# Altium schematic sheet relay_m66.SchDoc
size B; SheetNumber: 1; SheetTotal: 1
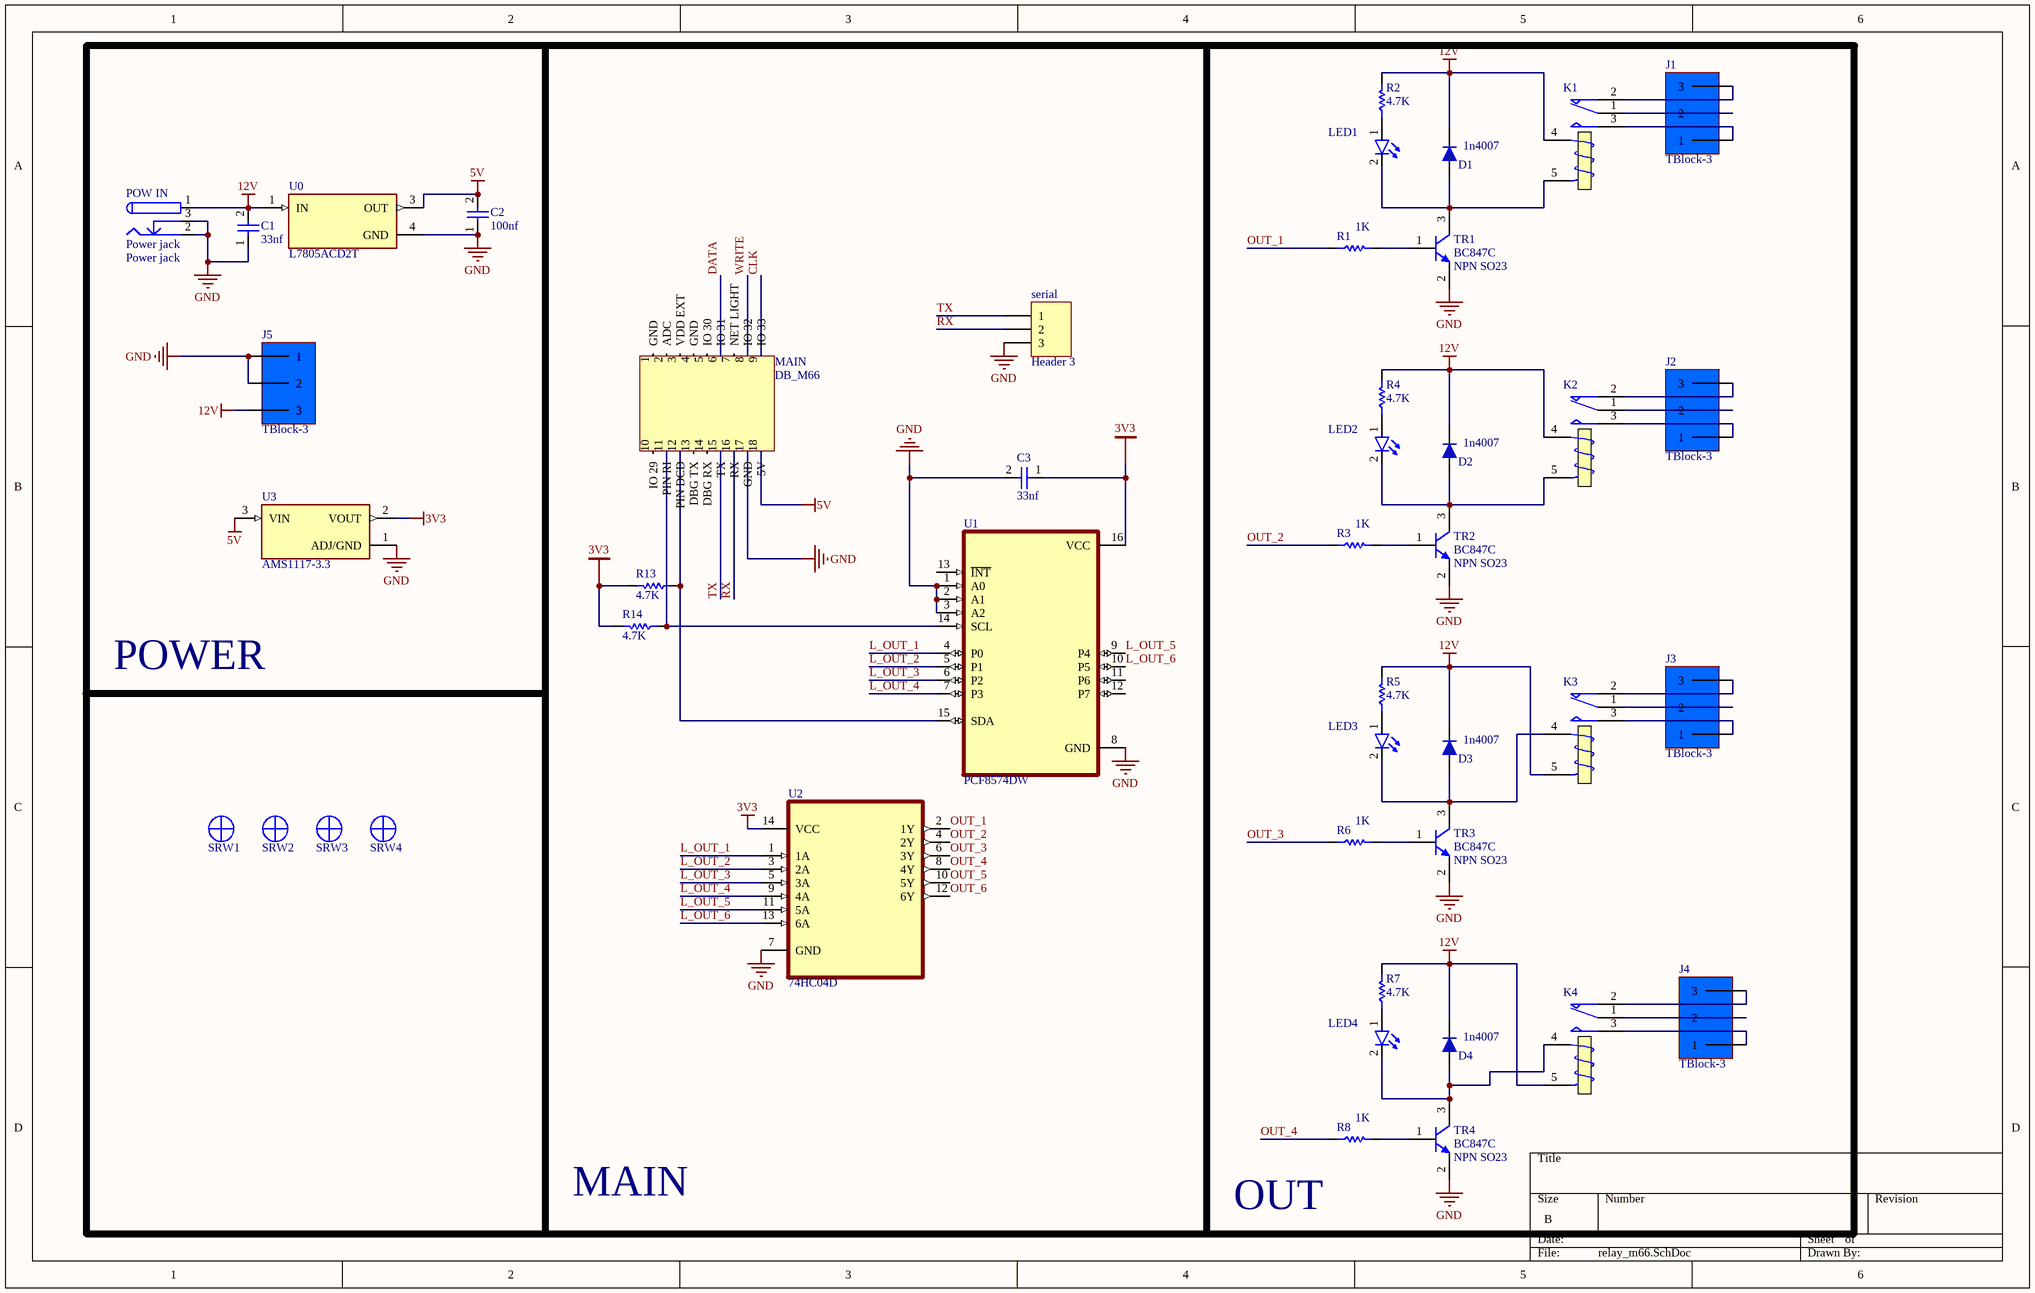
[diagram p0: relay_m66.SchDoc]

## Parts
C1  33nf  [SMD 0805]
C2  100nf  [SMD 0805]
C3  33nf  [SMD 0805]
D1  1n4007  [DIOM4629X24N]
D2  1n4007  [DIOM4629X24N]
D3  1n4007  [DIOM4629X24N]
D4  1n4007  [DIOM4629X24N]
J1  TBlock-3  [KF300-3 PIN]
J2  TBlock-3  [KF300-3 PIN]
J3  TBlock-3  [KF300-3 PIN]
J4  TBlock-3  [KF300-3 PIN]
J5  TBlock-3  [KF300-3 PIN]
K1  (no value)  [Relay 18.85x15.35x15.70]
K2  (no value)  [Relay 18.85x15.35x15.70]
K3  (no value)  [Relay 18.85x15.35x15.70]
K4  (no value)  [Relay 18.85x15.35x15.70]
LED1  LED 2PIN  [LED 0805]  (value not drawn)
LED2  LED 2PIN  [LED 0805]  (value not drawn)
LED3  LED 2PIN  [LED 0805]  (value not drawn)
LED4  LED 2PIN  [LED 0805]  (value not drawn)
MAIN  DB_M66  [DB_M66]
POW_IN  Power jack  [Power Jack]
R1  1K  [0805_1/8W]
R2  4.7K  [0805_1/8W]
R3  1K  [0805_1/8W]
R4  4.7K  [0805_1/8W]
R5  4.7K  [0805_1/8W]
R6  1K  [0805_1/8W]
R7  4.7K  [0805_1/8W]
R8  1K  [0805_1/8W]
R13  4.7K  [0805_1/8W]
R14  4.7K  [0805_1/8W]
serial  Header 3  [HDR1X3]
SRW1  Screw  [Board Screw]  (value not drawn)
SRW2  Screw  [Board Screw]  (value not drawn)
SRW3  Screw  [Board Screw]  (value not drawn)
SRW4  Screw  [Board Screw]  (value not drawn)
TR1  BC847C  [SOT23_BEC_M]
TR2  BC847C  [SOT23_BEC_M]
TR3  BC847C  [SOT23_BEC_M]
TR4  BC847C  [SOT23_BEC_M]
U0  L7805ACD2T  [VREG_L7805ACD2T]
U1  PCF8574DW  [SOIC127P1030X265-16N]
U2  74HC04D  [SOIC127P600X175-14N]
U3  AMS1117-3.3  [SOT229P700X180-4N]

## Nets
3V3: C3.1 R13.2 R14.2 U1.16(VCC) U2.14(VCC) U3.2(VOUT)
5V: C2.2 MAIN.18(5V) U0.3(OUT) U3.3(VIN)
12V: C1.2 D1.2 D2.2 D3.2 D4.2 J5.3 K1.4(T1) K2.4(T1) K3.5(T2) K4.5(T2) POW_IN.1 R2.2 R4.2 R5.2 R7.2 U0.1(IN)
GND: C1.1 C2.1 C3.2 J5.1 J5.2 MAIN.17(GND) POW_IN.2 POW_IN.3 serial.3 TR1.2(E) TR2.2(E) TR3.2(E) TR4.2(E) U0.4(GND) U1.1(A0) U1.2(A1) U1.3(A2) U1.8(GND) U2.7(GND) U3.1(ADJ/GND)
CLK: MAIN.9(IO_33)
DATA: MAIN.6(IO_31)
L_OUT_1: U1.4(P0) U2.1(1A)
L_OUT_2: U1.5(P1) U2.3(2A)
L_OUT_3: U1.6(P2) U2.5(3A)
L_OUT_4: U1.7(P3) U2.9(4A)
L_OUT_5: U1.9(P4) U2.11(5A)
L_OUT_6: U1.10(P5) U2.13(6A)
OUT_1: R1.1 U2.2(1Y)
OUT_2: R3.1 U2.4(2Y)
OUT_3: R6.1 U2.6(3Y)
OUT_4: R8.1 U2.8(4Y)
OUT_5: U2.10(5Y)
OUT_6: U2.12(6Y)
RX: MAIN.16(RX) serial.2
TX: MAIN.15(TX) serial.1
WRITE: MAIN.8(IO_32)
NetD1_1: D1.1 K1.5(T2) LED1.2(K) TR1.3(C)
NetD2_1: D2.1 K2.5(T2) LED2.2(K) TR2.3(C)
NetD3_1: D3.1 K3.4(T1) LED3.2(K) TR3.3(C)
NetD4_1: D4.1 K4.4(T1) LED4.2(K) TR4.3(C)
NetJ1_1: J1.1 K1.3(NO)
NetJ1_2: J1.2 K1.1(COM)
NetJ1_3: J1.3 K1.2(NC)
NetJ2_1: J2.1 K2.3(NO)
NetJ2_2: J2.2 K2.1(COM)
NetJ2_3: J2.3 K2.2(NC)
NetJ3_1: J3.1 K3.3(NO)
NetJ3_2: J3.2 K3.1(COM)
NetJ3_3: J3.3 K3.2(NC)
NetJ4_1: J4.1 K4.3(NO)
NetJ4_2: J4.2 K4.1(COM)
NetJ4_3: J4.3 K4.2(NC)
NetLED1_1: LED1.1(A) R2.1
NetLED2_1: LED2.1(A) R4.1
NetLED3_1: LED3.1(A) R5.1
NetLED4_1: LED4.1(A) R7.1
NetMAIN_11: MAIN.11(PIN_RI) R14.1 U1.14(SCL)
NetMAIN_12: MAIN.12(PIN_DCD) R13.1 U1.15(SDA)
NetR1_2: R1.2 TR1.1(B)
NetR3_2: R3.2 TR2.1(B)
NetR6_2: R6.2 TR3.1(B)
NetR8_2: R8.2 TR4.1(B)

Not connected (* = marked no-connect by the designer): MAIN 1(GND) 2(ADC) 3(VDD_EXT) 4(GND) 5(IO_30) 7(NET_LIGHT) 10(IO_29) 13(DBG_TX) 14(DBG_RX); U1 11(P6) 12(P7) 13(~{INT})

## Notes on the sheet
- POWER
- MAIN
- (near R8) OUT
- (in symbol NPN SMD) NPN SO23

## Library data of the parts
C1-C3 = CAP NON
D1-D4 = 1n4007 SMD M7: Standard Rectifiers; Part. No: M7; Manufacturer: DC COMPONENTS; Designer: Abbas Basereh; Link: http://www.tme.eu/en/details/m7/smd-universal-diodes/dc-components/; Link: https://www.aliexpress.com/item/Smd-tube-1n4007-m7-SMA/1213719741.html?spm=2114.01010208.3.1.ZyZ7bC&ws_ab_test=searchweb0_0,searchweb201602_4_10065_10068_10084_10083_10080_10082_10081_10060_10061_10062_10056_10055_10054_10059_10099_10078_10079_427_10073_10103_10102_10096_10052_10050_10051,searchweb201603_4&btsid=db2be5ca-e560-400a-b91c-484ab5ee228b; Data: 16-12-2016
K1-K4 = Relay_SPDT: Single-Pole Dual-Throw Relay; Designer: Abbas Basereh; Mounting Technology: Through-Hole; ComponentLink1Description: Datasheet; Pin Count: 0; Update Date: 2017-3-1
R1-R8 R13 R14 = RESISTOR
serial = Header 3: Header, 3-Pin; LatestRevisionDate: 17-Jul-2002; LatestRevisionNote: Re-released for DXP Platform.; Publisher: Altium Limited
SRW1-SRW4 = Board Screw 3MM: Board Screw With Spacer
TR1-TR4 = NPN SMD
U0 = L7805ACD2T: Linear Voltage Regulator IC 1 Output 1.5A D2PAK; MF: STMicroelectronics; Value: *; SnapEDA_Link: https://www.snapeda.com/parts/L7805ACD2T/STMicroelectronics/view-part/680973/?ref=snap; Price: None; Availability: Unavailable; Package: D2PAK STMicroelectronics; MP: L7805ACD2T
U1 = PCF8574DW: Remote 8-Bit I/O Expander for I2C-Bus 16-SOIC -40 to 85; MF: Texas Instruments; Package: SOIC-16 Texas Instruments; SnapEDA_Link: https://www.snapeda.com/parts/PCF8574DW/Texas%20Instruments/view-part/480923/?ref=snap; DigiKey-Purchase-URL: https://snapeda.com/shop?store=DigiKey&id=480923; MP: PCF8574DW; Value: *; Availability: Unavailable; Texas_Instruments-Purchase-URL: https://snapeda.com/shop?store=Texas+Instruments&id=480923; Price: None; Mouser-Purchase-URL: https://snapeda.com/shop?store=Mouser&id=480923
U2 = 74HC04D: Inverter IC 6 Channel 14-SOIC; MF: Toshiba; Value: *; MP: 74HC04D; Package: SOIC-14 NXP Semiconductors; Price: None; Availability: Unavailable; SnapEDA_Link: https://www.snapeda.com/parts/74HC04D/Toshiba%20Semiconductor%20and%20Storage/view-part/1040011/?ref=snap
U3 = AMS1117-3.3: Sot223/Pkg 1-Amp 3.3-Volt Low Drop Out Voltage Regulatator; MF: Advanced Monolithic Systems; Price: None; Package: None; Value: *; MP: AMS1117-3.3; Availability: Unavailable; SnapEDA_Link: https://www.snapeda.com/parts/AMS1117-3.3/Advanced%20Monolithic%20Systems/view-part/53450/?ref=snap